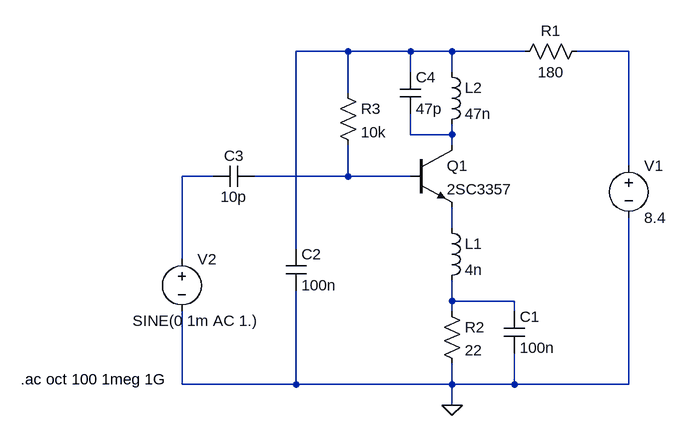
[diagram p0: schematic rf amp.asc]
rf amp.asc, the LTspice schematic file:
Version 4
SHEET 1 880 680
WIRE 32 -64 -48 -64
WIRE 128 -64 32 -64
WIRE 192 -64 128 -64
WIRE 304 -64 192 -64
WIRE 464 -64 384 -64
WIRE 128 -32 128 -64
WIRE 192 -32 192 -64
WIRE 32 0 32 -64
WIRE 128 64 128 32
WIRE 192 64 192 48
WIRE 192 64 128 64
WIRE 192 80 192 64
WIRE 464 112 464 -64
WIRE -176 128 -224 128
WIRE 32 128 32 80
WIRE 32 128 -112 128
WIRE 128 128 32 128
WIRE 192 208 192 176
WIRE -48 240 -48 -64
WIRE -224 256 -224 128
WIRE 192 320 192 288
WIRE 288 320 192 320
WIRE 192 336 192 320
WIRE 288 336 288 320
WIRE -224 448 -224 336
WIRE -48 448 -48 304
WIRE -48 448 -224 448
WIRE 192 448 192 416
WIRE 192 448 -48 448
WIRE 288 448 288 400
WIRE 288 448 192 448
WIRE 464 448 464 192
WIRE 464 448 288 448
WIRE 192 480 192 448
FLAG 192 480 0
SYMBOL npn 128 80 R0
SYMATTR InstName Q1
SYMATTR Value 2SC3357
SYMBOL ind 176 192 R0
SYMATTR InstName L1
SYMATTR Value 4n
SYMBOL ind 176 -48 R0
SYMATTR InstName L2
SYMATTR Value 47n
SYMBOL voltage 464 96 R0
WINDOW 123 0 0 Left 2
WINDOW 39 0 0 Left 2
SYMATTR InstName V1
SYMATTR Value 8.4
SYMBOL res 400 -80 R90
WINDOW 0 0 56 VBottom 2
WINDOW 3 32 56 VTop 2
SYMATTR InstName R1
SYMATTR Value 180
SYMBOL res 176 320 R0
SYMATTR InstName R2
SYMATTR Value 22
SYMBOL cap 272 336 R0
SYMATTR InstName C1
SYMATTR Value 100n
SYMBOL res 16 -16 R0
SYMATTR InstName R3
SYMATTR Value 10k
SYMBOL cap -64 240 R0
SYMATTR InstName C2
SYMATTR Value 100n
SYMBOL voltage -224 240 R0
WINDOW 3 -76 110 Left 2
WINDOW 123 0 0 Left 2
WINDOW 39 0 0 Left 2
SYMATTR InstName V2
SYMATTR Value SINE(0 1m AC 1.)
SYMBOL cap -112 112 R90
WINDOW 0 0 32 VBottom 2
WINDOW 3 32 32 VTop 2
SYMATTR InstName C3
SYMATTR Value 10p
SYMBOL cap 112 -32 R0
SYMATTR InstName C4
SYMATTR Value 47p
SYMATTR SpiceLine Rser=20
TEXT -472 440 Left 2 !.ac oct 100 1meg 1G

The netlist it stands for:
* rf amp.asc
Q1 N003 N005 N006 0 2SC3357
L1 N006 N007 4n
L2 N001 N003 47n
V1 N002 0 8.4
R1 N002 N001 180
R2 N007 0 22
C1 N007 0 100n
R3 N001 N005 10k
C2 N001 0 100n
V2 N004 0 SINE(0 1m AC 1.)
C3 N005 N004 10p
C4 N001 N003 47p Rser=20
.model NPN NPN
.model PNP PNP
.lib standard.bjt
.ac oct 100 1meg 1G
.backanno
.end